# Altium schematic sheet Sheet1.SchDoc
size A4
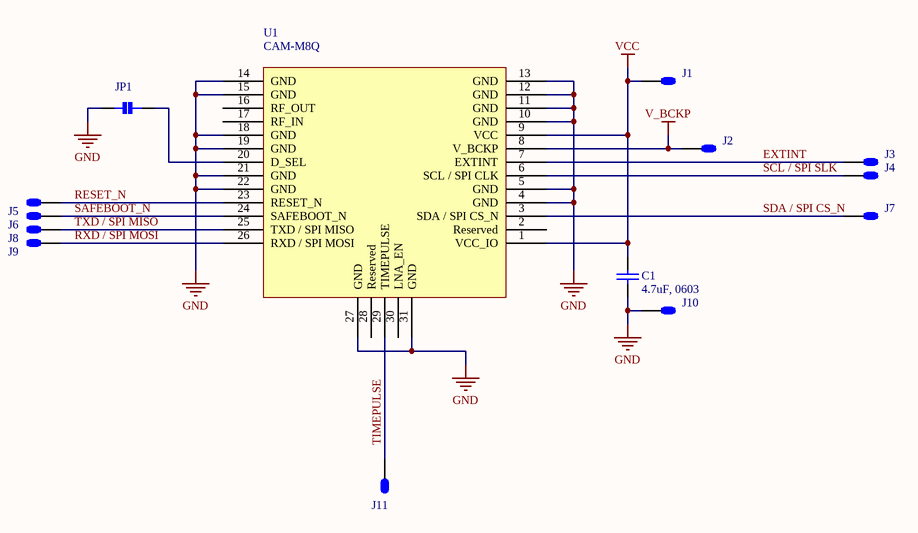
[diagram p0: Sheet1.SchDoc]

## Parts
C1  4.7uF, 0603  [Capacitor 0603]
J1  Wire To Board Solder Pad  [Wire To Board Solder Pad]  (value not drawn)
J2  Wire To Board Solder Pad  [Wire To Board Solder Pad]  (value not drawn)
J3  Wire To Board Solder Pad  [Wire To Board Solder Pad]  (value not drawn)
J4  Wire To Board Solder Pad  [Wire To Board Solder Pad]  (value not drawn)
J5  Wire To Board Solder Pad  [Wire To Board Solder Pad]  (value not drawn)
J6  Wire To Board Solder Pad  [Wire To Board Solder Pad]  (value not drawn)
J7  Wire To Board Solder Pad  [Wire To Board Solder Pad]  (value not drawn)
J8  Wire To Board Solder Pad  [Wire To Board Solder Pad]  (value not drawn)
J9  Wire To Board Solder Pad  [Wire To Board Solder Pad]  (value not drawn)
J10  Wire To Board Solder Pad  [Wire To Board Solder Pad]  (value not drawn)
J11  Wire To Board Solder Pad  [Wire To Board Solder Pad]  (value not drawn)
JP1  Solder Jumper  [Solder Jumper]  (value not drawn)
U1  CAM-M8Q  [CAM-M8Q]

## Nets
GND: C1.1 J10.1 JP1.1 U1.4(GND) U1.5(GND) U1.10(GND) U1.11(GND) U1.12(GND) U1.13(GND) U1.14(GND) U1.15(GND) U1.18(GND) U1.19(GND) U1.21(GND) U1.22(GND) U1.27(GND) U1.31(GND)
V_BCKP: J2.1 U1.8(V_BCKP)
VCC: C1.2 J1.1 U1.1(VCC_IO) U1.9(VCC)
EXTINT: J3.1 U1.7(EXTINT)
RESET_N: J5.1 U1.23(RESET_N)
RXD / SPI MOSI: J9.1 U1.26(RXD_/_SPI_MOSI)
SAFEBOOT_N: J6.1 U1.24(SAFEBOOT_N)
SCL / SPI SLK: J4.1 U1.6(SCL_/_SPI_CLK)
SDA / SPI CS_N: J7.1 U1.3(SDA_/_SPI_CS_N)
TIMEPULSE: J11.1 U1.29(TIMEPULSE)
TXD / SPI MISO: J8.1 U1.25(TXD_/_SPI_MISO)
NetJP1_2: JP1.2 U1.20(D_SEL)

Not connected (* = marked no-connect by the designer): U1 2(Reserved) 16(RF_OUT) 17(RF_IN) 28(Reserved) 30(LNA_EN)

## Library data of the parts
C1 = Capacitor